# EasyEDA Pro project ldos.epro

# Schematic Split_Rail

## Sheets
1 pos_LDO: Board Name: Split_Rail; Create Date: 2024-07-03; Page Name: pos_LDO; Project Name: es9039q2m_dac; Schematic Name: Split_Rail; Update Date: 2024-08-09
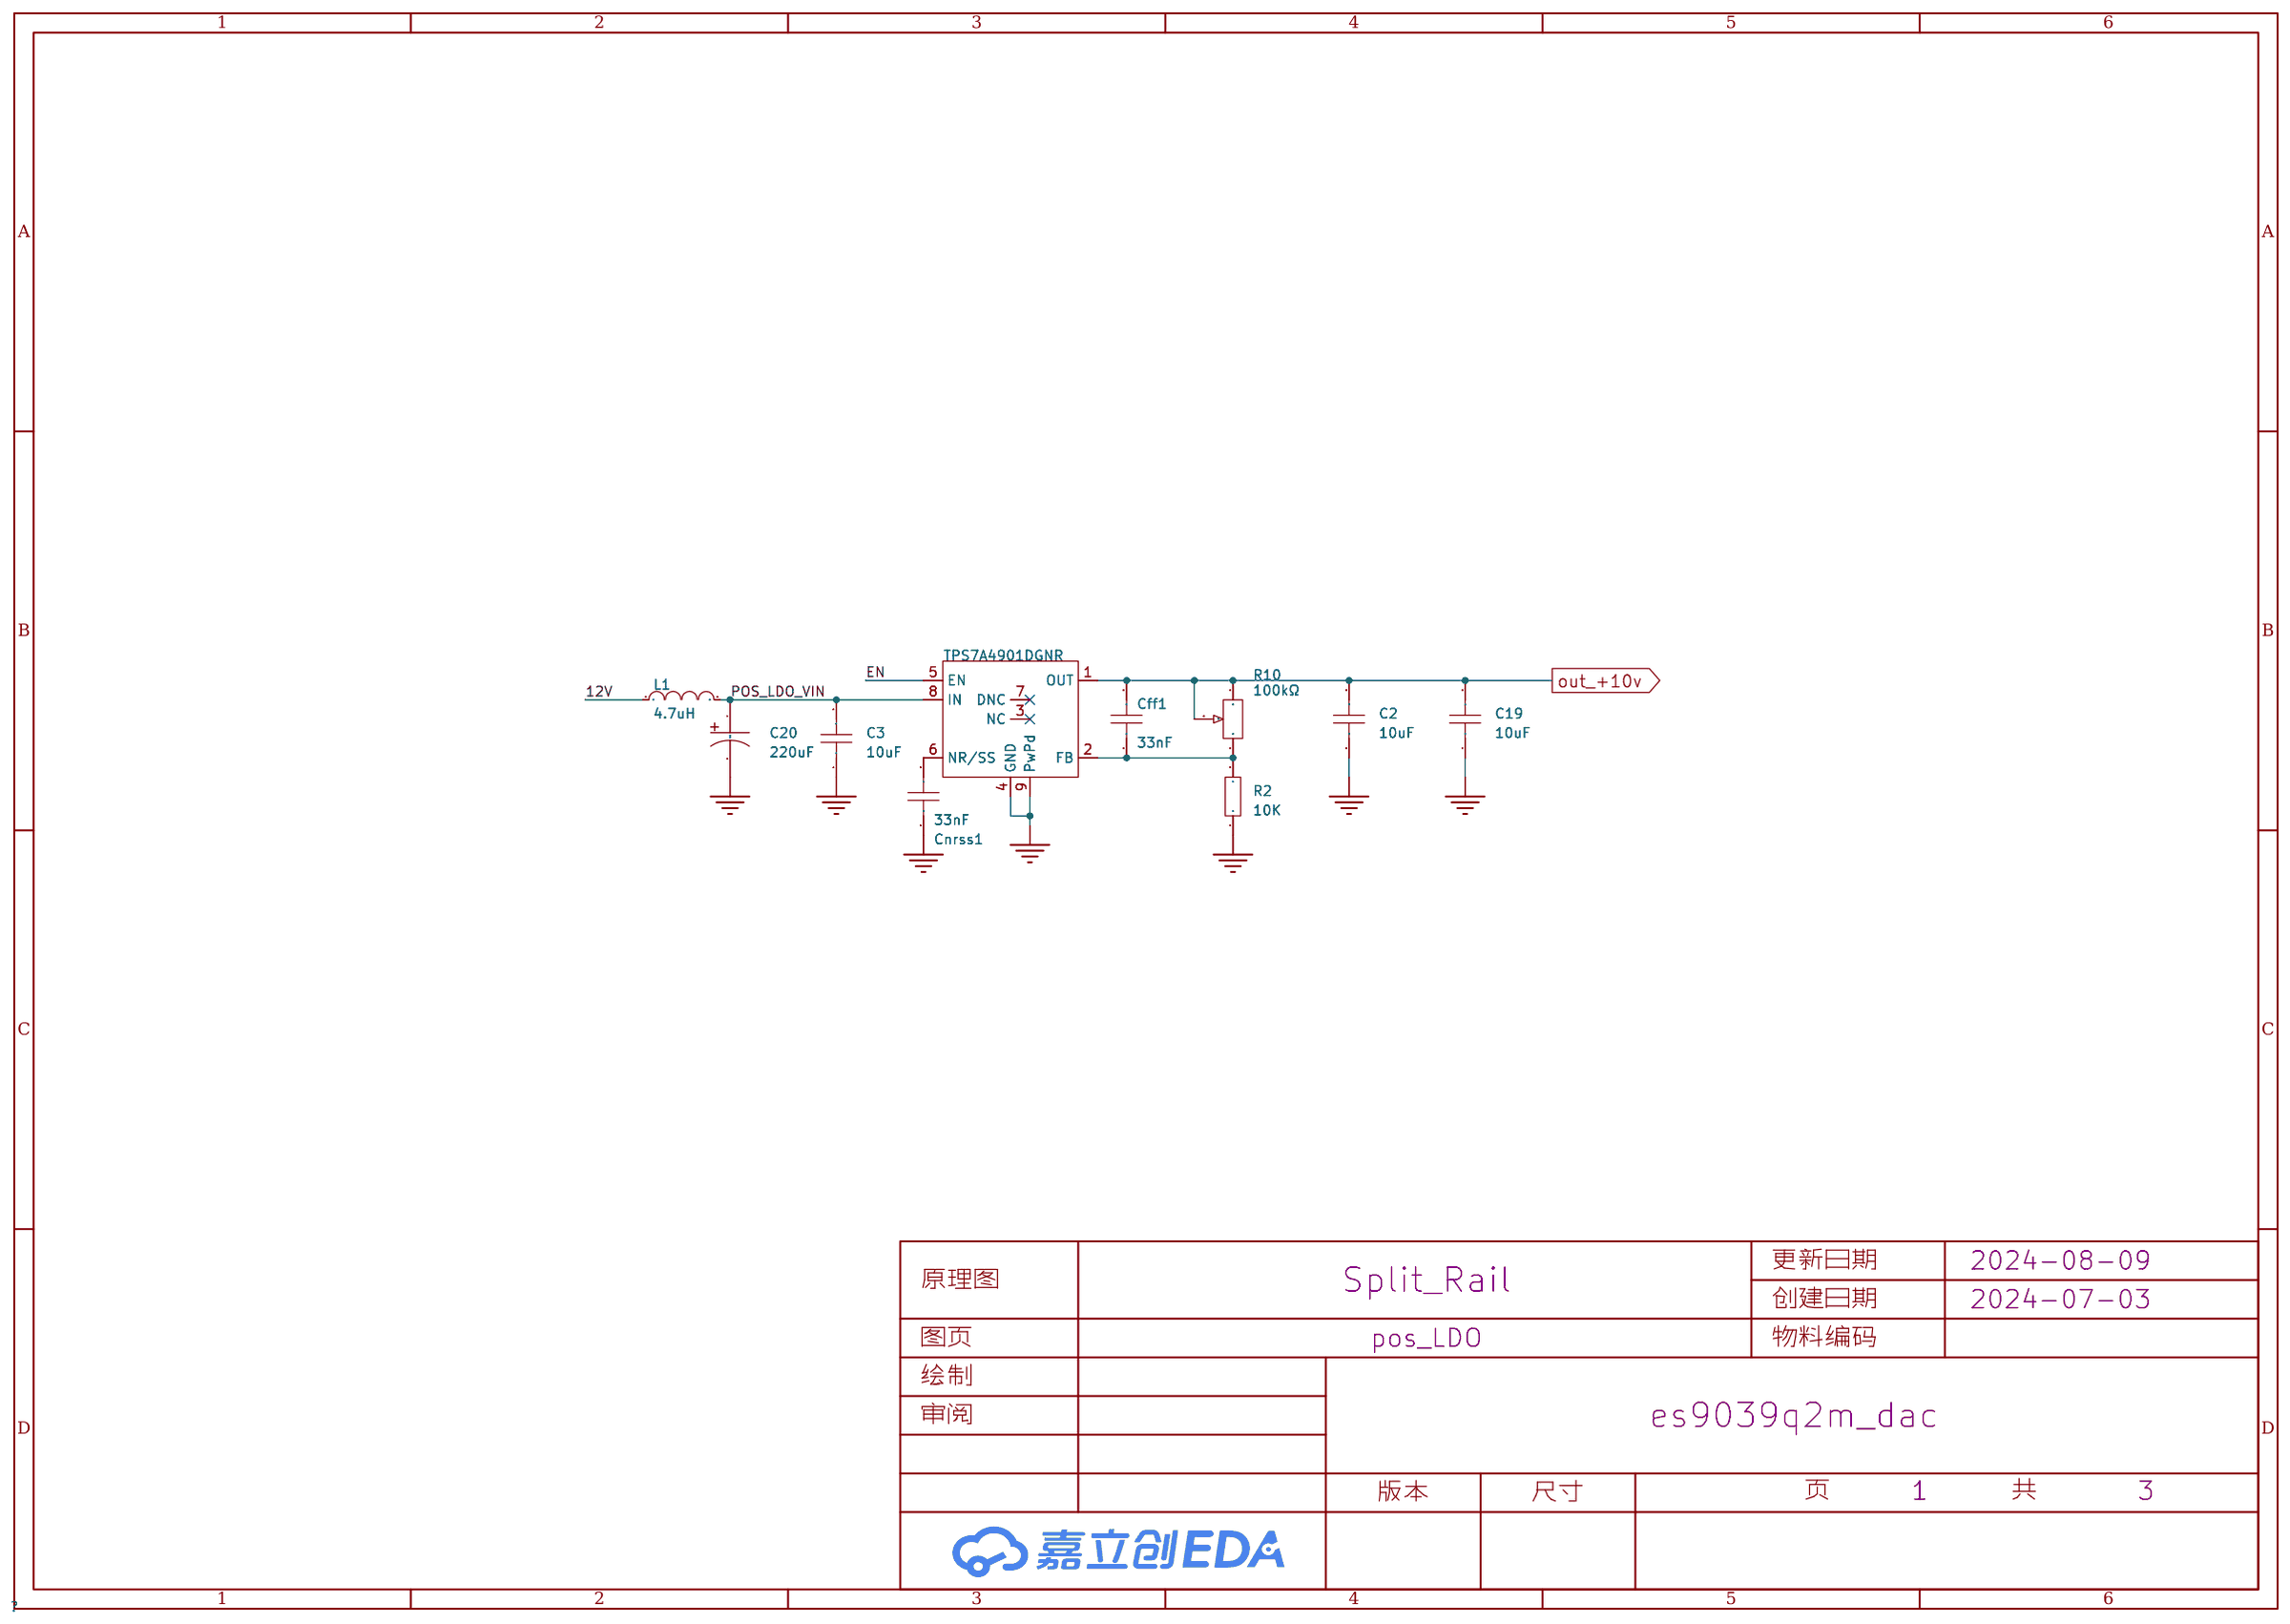
[diagram p0: pos_LDO]
2 neg_LDO: Page Name: neg_LDO; Update Date: 2024-08-08
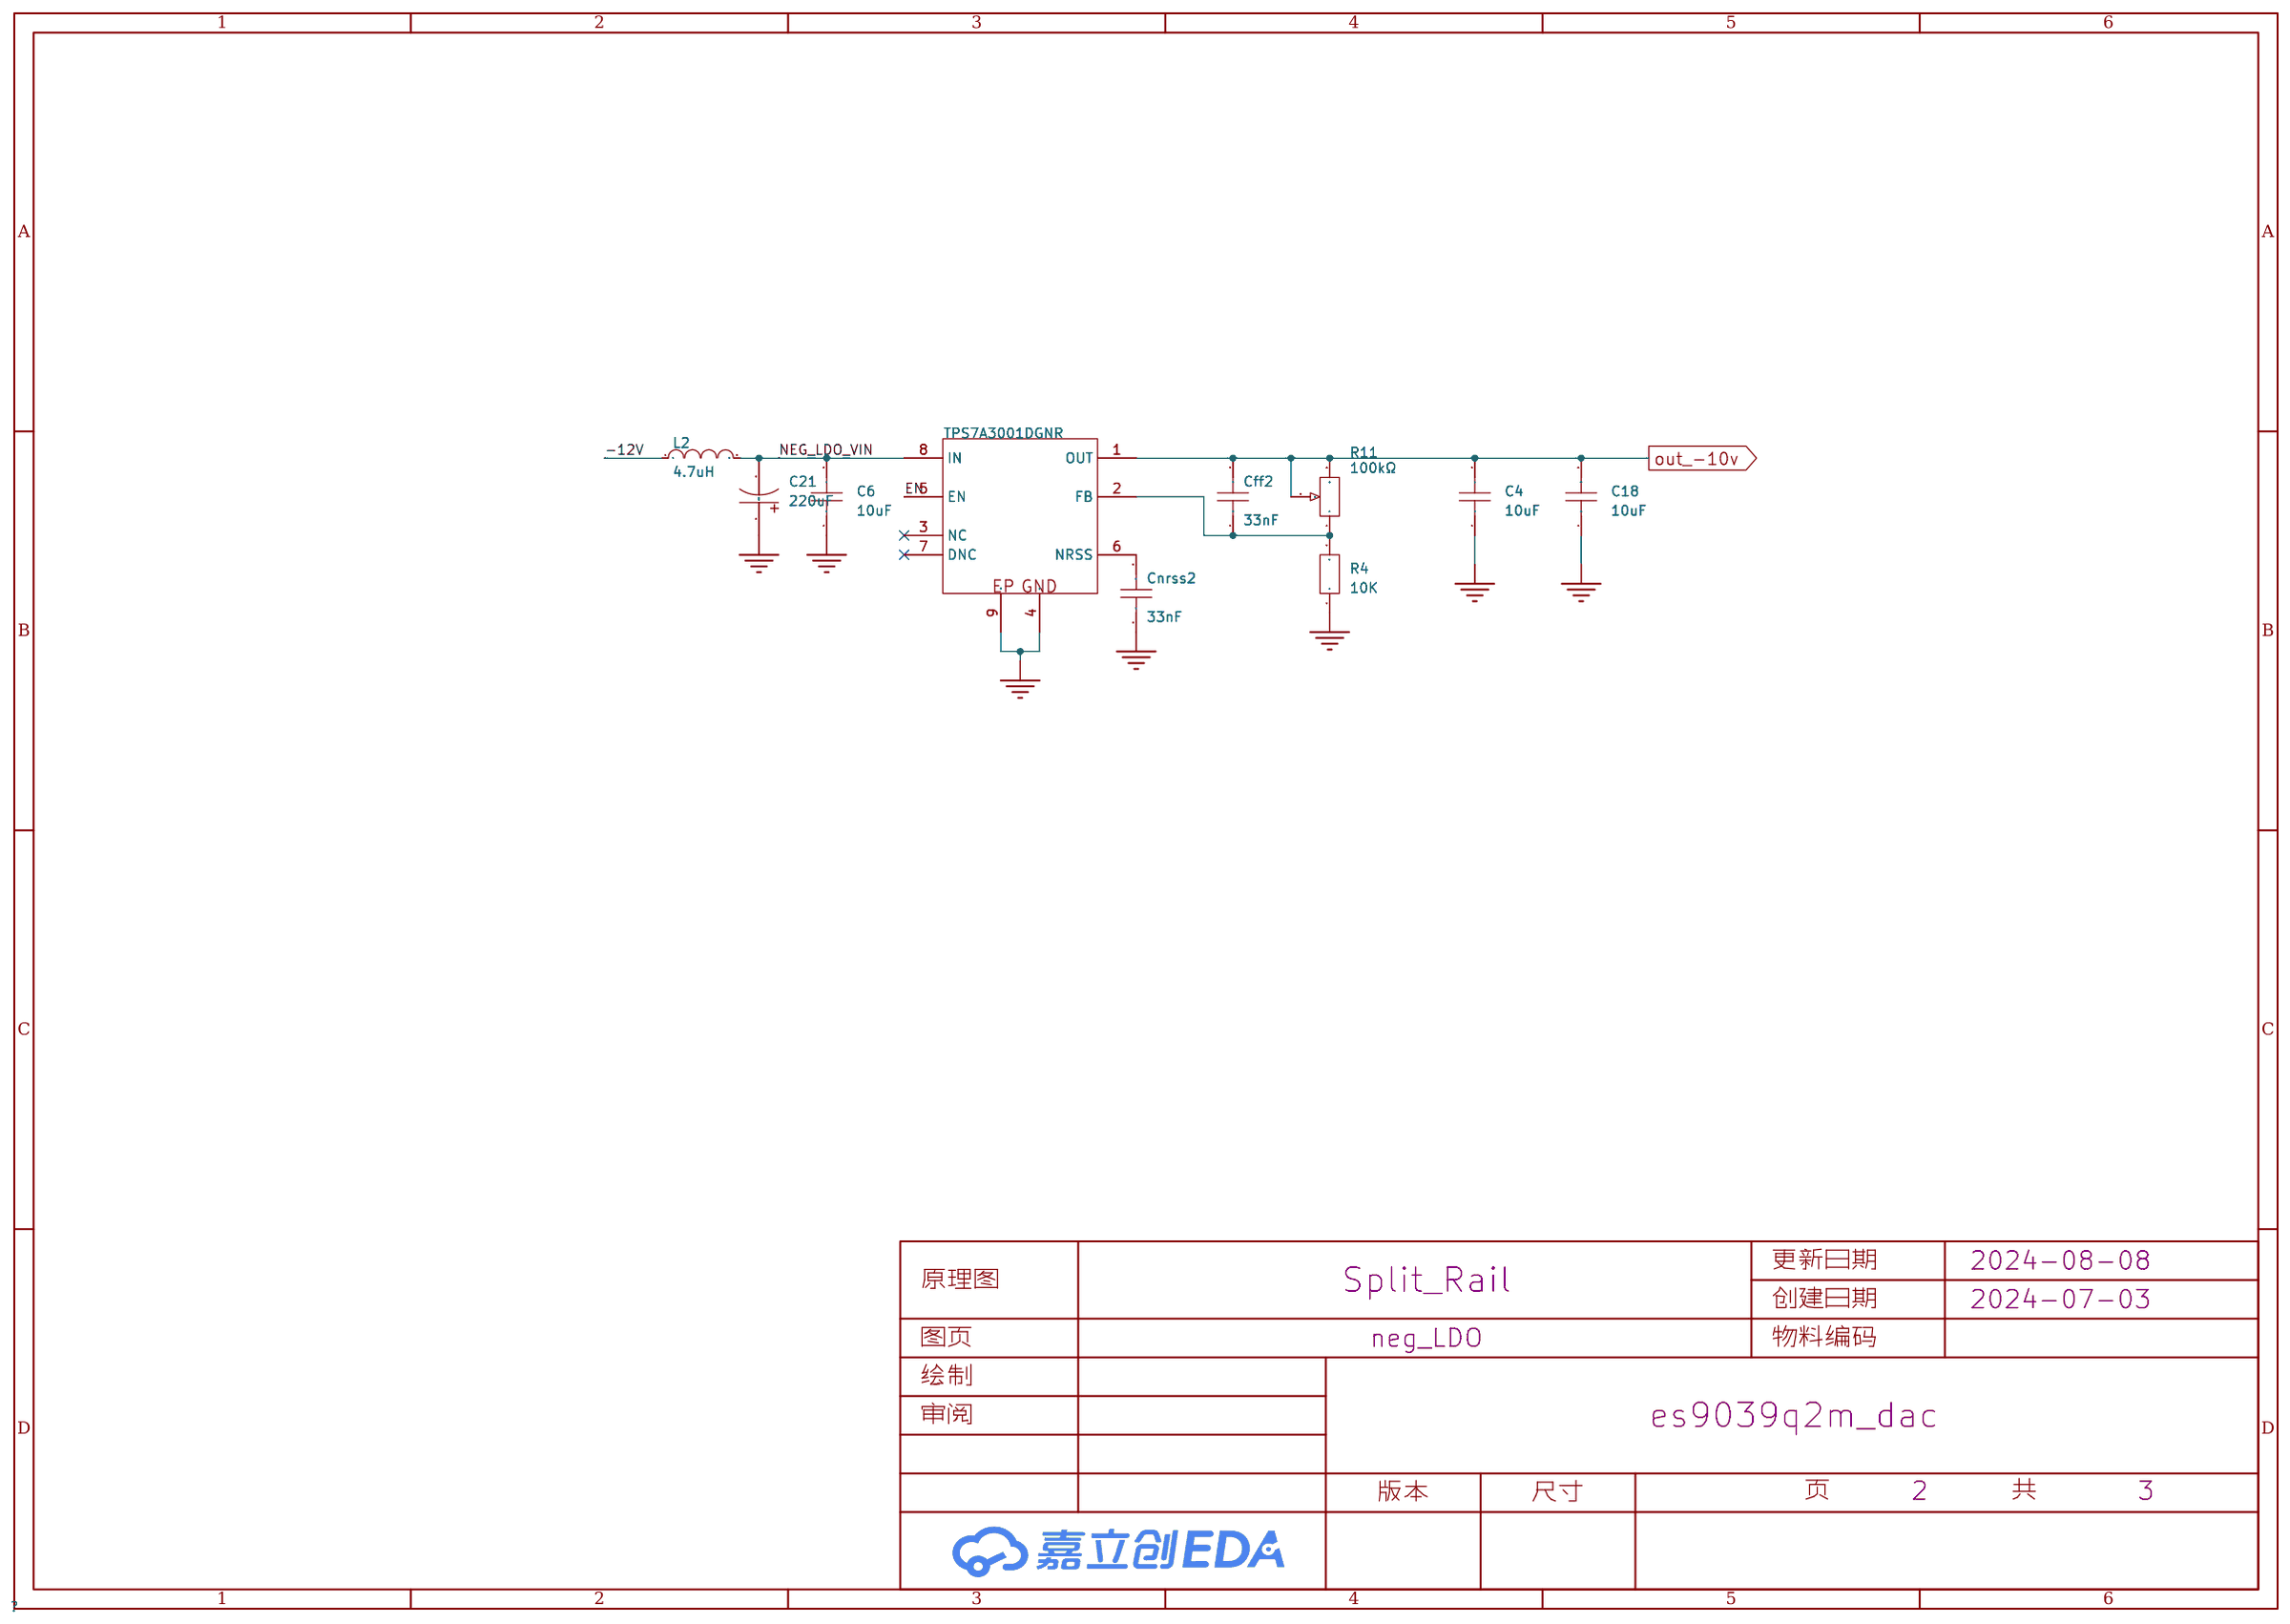
[diagram p1: neg_LDO]

## Parts
sheet neg_LDO
C4  10uF  [C0805]
C6  10uF  [C0805]
C18  10uF  [C0805]
C21  220uF  [CAP-TH_BD6.3-P2.50-D1.0-FD]
Cff2  33nF  [C1206]
Cnrss2  33nF  [C1206]
L2  4.7uH  [L1206]
R4  10K  [R0603]
R11  100kΩ  [RES-ADJ-TH_3P-L9.5-W4.9-P2.50-L_3296W]
U2  TPS7A3001DGNR  [MSOP-8_L3.0-W3.0-P0.65-LS5.0-BL-EP]
sheet pos_LDO
C2  10uF  [C0805]
C3  10uF  [C0805]
C19  10uF  [C0805]
C20  220uF  [CAP-TH_BD6.3-P2.50-D1.0-FD]
Cff1  33nF  [C1206]
Cnrss1  33nF  [C1206]
L1  4.7uH  [L1206]
R2  10K  [R0603]
R10  100kΩ  [RES-ADJ-TH_3P-L9.5-W4.9-P2.50-L_3296W]
U1  TPS7A4901DGNR  [MSOP-8_L3.0-W3.0-P0.65-LS5.0-BL-EP]

## Library data of the parts
C2-C4 C6 C18 C19 = 0805B106K160NT: 容值:10uF;精度:±10%;额定电压:16V;材质(温度系数):X7R;; LCSC Part Name: 10uF ±10% 16V; Supplier Part: C92341; Manufacturer: FH(风华); Supplier Footprint: 0805; Datasheet: https://atta.szlcsc.com/upload/public/pdf/source/20200305/C486355_26A10D38EF8C2A5C37091D0039909270.pdf; Supplier: LCSC; Tolerance: ±10%; Voltage Rated: 16V; Temperature Coefficient: X7R
C20 C21 = 16PX220MEFC6.3*11: 容值:220uF;精度:±20%;额定电压:16V;纹波电流:220mA@120Hz;等效串联电阻:-;; LCSC Part Name: 220uF ±20% 16V; Supplier Part: C129236; Manufacturer: rubycon(红宝石); Supplier Footprint: 插件,D6.3xL11mm; JLCPCB Part Class: 扩展库; Datasheet: https://atta.szlcsc.com/upload/public/pdf/source/20180224/C129236_15194361083071363309.pdf; Supplier: LCSC; Tolerance: ±20%; Rated Voltage: 16V; Ripple Current: 220mA@120Hz; Lead Spacing: 2.5mm; φD: 6.3mm; L: 11mm; Lifetime @ Temp: 1000hrs@105℃; Operating Temperature: -25℃~+105℃
Cff1 Cff2 Cnrss1 Cnrss2 = HHV1206R7333K251NSLJ: 容值:33nF;精度:±10%;额定电压:250V;材质(温度系数):X7R;; LCSC Part Name: 33nF ±10% 250V; Supplier Part: C5186850; Manufacturer: Chinocera(华瓷); Supplier Footprint: 1206; Datasheet: https://atta.szlcsc.com/upload/public/pdf/source/20240320/7913236AA18747E5EA43CE828F8C8ED9.pdf; Supplier: LCSC; Tolerance: ±10%; Voltage Rated: 250V; Temperature Coefficient: X7R
L1 L2 = CMI321609U4R7KT: 电感值:4.7uH;精度:±10%;额定电流:25mA;饱和电流(Isat):-;直流电阻(DCR):650mΩ;; LCSC Part Name: 4.7uH ±10%; Supplier Part: C1049; Manufacturer: FH(风华); Supplier Footprint: 1206; Datasheet: https://atta.szlcsc.com/upload/public/pdf/source/20230223/88BF0F64804B4350E07D929F36C73B7F.pdf; Supplier: LCSC; Tolerance: ±10%; Rated Current: 25mA; DC Resistance (DCR): 650mΩ; Q @ Freq: 35@10MHz; Frequency - Self Resonant: 35MHz
R2 R4 = Res_0603: Supplier Footprint: 0603; Check: false
R10 R11 = 3296W-1-104: 阻值:100kΩ;精度:±10%;; LCSC Part Name: 100kΩ ±10%; Supplier Part: C118963; Manufacturer: BOCHEN(博晨); Supplier Footprint: 插件; JLCPCB Part Class: 扩展库; Datasheet: https://atta.szlcsc.com/upload/public/pdf/source/20171114/C118963_15106326662041117450.pdf; Supplier: LCSC; Tolerance: ±10%
U2 = TPS7A3001DGNR: 输出类型:可调;最大输入电压:35V;输出电压:1.18V~33V;最大输出电流:200mA;电源纹波抑制比(PSRR):72dB@(120Hz);输出极性:负极;; LCSC Part Name: ADJ 输入35V 输出1.18V~33V 200mA; Supplier Part: C33835; Manufacturer: TI(德州仪器); Supplier Footprint: HVSSOP-8; Datasheet: https://www.ti.com/cn/lit/gpn/tps7a30; Supplier: LCSC; Output Type: 可调; Maximum Input Voltage: 35V; Output Voltage: 1.18V~33V; MAX Output Current: 200mA; Power Supply Rejection Ratio (PSRR): 72dB@(120Hz); Dropout Voltage: 600mV@(200mA); standby current: 100uA; Operating Temperature: -40℃~+125℃; Output Polarity: 负极; Number of Outputs: 1
U1 = TPS7A4901DGNR: 输出类型:可调;最大输入电压:35V;输出电压:1.194V~33V;最大输出电流:150mA;电源纹波抑制比(PSRR):78dB@(1kHz);输出极性:正极;; LCSC Part Name: ADJ 输入35V 输出1.176V~33V 150mA; Supplier Part: C16430; Manufacturer: TI(德州仪器); Supplier Footprint: HVSSOP-8; JLCPCB Part Class: 扩展库; Datasheet: https://www.ti.com/cn/lit/gpn/tps7a49; Supplier: LCSC; Output Type: 可调; Maximum Input Voltage: 35V; Output Voltage: 1.194V~33V; MAX Output Current: 150mA; Power Supply Rejection Ratio (PSRR): 78dB@(1kHz); Dropout Voltage: 450mV@(1A); standby current: 100uA; Operating Temperature: -40℃~+125℃; Output Polarity: 正极; Number of Outputs: 1

## Nets
12V: L1.1
-12V: L2.1
GND: C2.1 C3.1 C4.1 C6.1 C18.1 C19.1 C20.2 C21.1 Cnrss1.1 Cnrss2.1 R2.1 R4.1 U1.4(GND) U1.9(PwPd) U2.4(GND) U2.9(EP)
EN: U1.5(EN) U2.5(EN)
NEG_LDO_VIN: C6.2 C21.2 L2.2 U2.8(IN)
out_+10v: C2.2 C19.2 Cff1.2 R10.2 R10.3 U1.1(OUT)
out_-10v: C4.2 C18.2 Cff2.2 R11.2 R11.3 U2.1(OUT)
POS_LDO_VIN: C3.2 C20.1 L1.2 U1.8(IN)
Net-(Cff1-1): Cff1.1 R2.2 R10.1 U1.2(FB)
Net-(Cff2-1): Cff2.1 R4.2 R11.1 U2.2(FB)
Net-(Cnrss1-2): Cnrss1.2 U1.6(NR/SS)
Net-(Cnrss2-2): Cnrss2.2 U2.6(NRSS)

Not connected (* = marked no-connect by the designer): U1 3(NC)* 7(DNC)*; U2 3(NC)* 7(DNC)*
